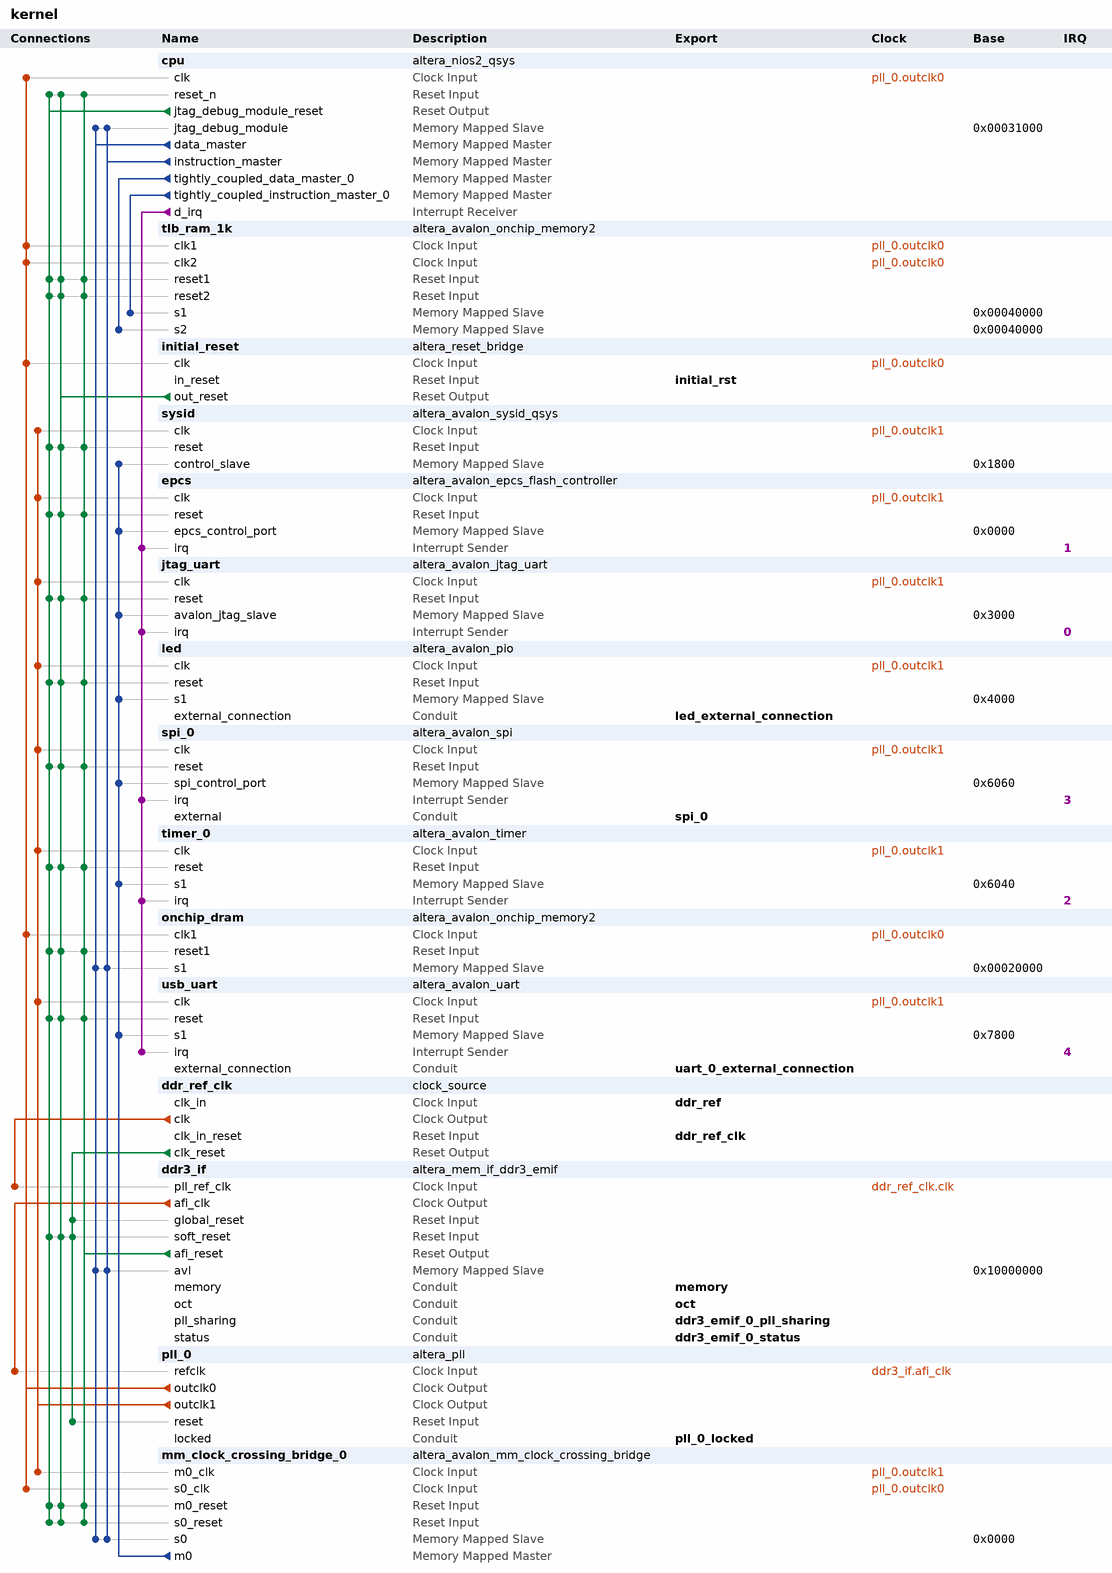
[diagram p0: system contents]
# Platform Designer (Qsys) system kernel, Cyclone V 5CEBA2F23C8
# Parameters at their usual value, and those the tool derives, are not listed.
package require -exact qsys 13.1
create_system kernel
set_project_property DEVICE_FAMILY {Cyclone V}
set_project_property DEVICE 5CEBA2F23C8

add_instance cpu altera_nios2_qsys 13.1
set_instance_parameter_value cpu muldiv_divider true
set_instance_parameter_value cpu mmu_enabled true
set_instance_parameter_value cpu mmu_autoAssignTlbPtrSz false
set_instance_parameter_value cpu manuallyAssignCpuID false
set_instance_parameter_value cpu resetSlave epcs.epcs_control_port
set_instance_parameter_value cpu mmu_TLBMissExcSlave tlb_ram_1k.s1
set_instance_parameter_value cpu exceptionSlave ddr3_if.avl
set_instance_parameter_value cpu breakSlave cpu.jtag_debug_module
set_instance_parameter_value cpu impl Fast
set_instance_parameter_value cpu icache_size 32768
set_instance_parameter_value cpu icache_numTCIM 1
set_instance_parameter_value cpu dcache_size 32768
set_instance_parameter_value cpu dcache_numTCDM 1

add_instance tlb_ram_1k altera_avalon_onchip_memory2 13.1
set_instance_parameter_value tlb_ram_1k dataWidth 32
set_instance_parameter_value tlb_ram_1k dualPort true
set_instance_parameter_value tlb_ram_1k initMemContent true
set_instance_parameter_value tlb_ram_1k initializationFileName onchip_mem.hex
set_instance_parameter_value tlb_ram_1k memorySize 1024

add_instance initial_reset altera_reset_bridge 13.1
set_instance_parameter_value initial_reset ACTIVE_LOW_RESET 1
set_instance_parameter_value initial_reset SYNCHRONOUS_EDGES deassert

add_instance sysid altera_avalon_sysid_qsys 13.1
set_instance_parameter_value sysid id 1577

add_instance epcs altera_avalon_epcs_flash_controller 13.1

add_instance jtag_uart altera_avalon_jtag_uart 13.1
set_instance_parameter_value jtag_uart simInteractiveOptions INTERACTIVE_ASCII_OUTPUT

add_instance led altera_avalon_pio 13.1
set_instance_parameter_value led direction Output
set_instance_parameter_value led width 4

add_instance spi_0 altera_avalon_spi 13.1
set_instance_parameter_value spi_0 clockPolarity 0
set_instance_parameter_value spi_0 dataWidth 8
set_instance_parameter_value spi_0 masterSPI true
set_instance_parameter_value spi_0 numberOfSlaves 1
set_instance_parameter_value spi_0 targetClockRate 20000000

add_instance timer_0 altera_avalon_timer 13.1
set_instance_parameter_value timer_0 period 1
set_instance_parameter_value timer_0 periodUnits MSEC

add_instance onchip_dram altera_avalon_onchip_memory2 13.1
set_instance_parameter_value onchip_dram dataWidth 32
set_instance_parameter_value onchip_dram dualPort false
set_instance_parameter_value onchip_dram initMemContent true
set_instance_parameter_value onchip_dram initializationFileName onchip_mem.hex
set_instance_parameter_value onchip_dram memorySize 32768

add_instance usb_uart altera_avalon_uart 13.1
set_instance_parameter_value usb_uart baud 115200
set_instance_parameter_value usb_uart dataBits 8
set_instance_parameter_value usb_uart fixedBaud true
set_instance_parameter_value usb_uart parity NONE
set_instance_parameter_value usb_uart stopBits 1

add_instance ddr_ref_clk clock_source 13.1
set_instance_parameter_value ddr_ref_clk clockFrequency 25000000

add_instance ddr3_if altera_mem_if_ddr3_emif 13.1
set_instance_parameter_value ddr3_if MEM_VENDOR Micron
set_instance_parameter_value ddr3_if MEM_FORMAT DISCRETE
set_instance_parameter_value ddr3_if MEM_CLK_FREQ_MAX 666.667
set_instance_parameter_value ddr3_if MEM_ROW_ADDR_WIDTH 13
set_instance_parameter_value ddr3_if MEM_COL_ADDR_WIDTH 10
set_instance_parameter_value ddr3_if MEM_DQ_WIDTH 16
set_instance_parameter_value ddr3_if MEM_BANKADDR_WIDTH 3
set_instance_parameter_value ddr3_if MEM_DRV_STR RZQ/6
set_instance_parameter_value ddr3_if MEM_RTT_WR {Dynamic ODT off}
set_instance_parameter_value ddr3_if MEM_WTCL 6
set_instance_parameter_value ddr3_if MEM_TCL 7
set_instance_parameter_value ddr3_if TIMING_TIS 190
set_instance_parameter_value ddr3_if TIMING_TIH 140
set_instance_parameter_value ddr3_if TIMING_TDS 30
set_instance_parameter_value ddr3_if TIMING_TDH 65
set_instance_parameter_value ddr3_if TIMING_TDQSQ 125
set_instance_parameter_value ddr3_if TIMING_TDQSCK 255
set_instance_parameter_value ddr3_if TIMING_TDQSS 0.25
set_instance_parameter_value ddr3_if TIMING_TQSH 0.4
set_instance_parameter_value ddr3_if TIMING_TDSH 0.2
set_instance_parameter_value ddr3_if TIMING_TDSS 0.2
set_instance_parameter_value ddr3_if MEM_TRAS_NS 36.0
set_instance_parameter_value ddr3_if MEM_TRCD_NS 13.5
set_instance_parameter_value ddr3_if MEM_TRP_NS 13.5
set_instance_parameter_value ddr3_if MEM_TRFC_NS 110.0
set_instance_parameter_value ddr3_if MEM_TWTR 4
set_instance_parameter_value ddr3_if MEM_TFAW_NS 45.0
set_instance_parameter_value ddr3_if MEM_TRRD_NS 7.5
set_instance_parameter_value ddr3_if MEM_TRTP_NS 7.5
set_instance_parameter_value ddr3_if RATE Half
set_instance_parameter_value ddr3_if MEM_CLK_FREQ 350.0
set_instance_parameter_value ddr3_if SPEED_GRADE 8
set_instance_parameter_value ddr3_if HARD_EMIF false
set_instance_parameter_value ddr3_if POWER_OF_TWO_BUS true
set_instance_parameter_value ddr3_if AVL_MAX_SIZE 4
set_instance_parameter_value ddr3_if PRIORITY_PORT 1,1,1,1,1,1
set_instance_parameter_value ddr3_if CPORT_TYPE_PORT Bidirectional,Bidirectional,Bidirectional,Bidirectional,Bidirectional,Bidirectional
set_instance_parameter_value ddr3_if REF_CLK_FREQ 25.0
set_instance_parameter_value ddr3_if DEFAULT_FAST_SIM_MODEL true
set_instance_parameter_value ddr3_if EXPORT_AFI_HALF_CLK false
set_instance_parameter_value ddr3_if PLL_LOCATION Top_Bottom
set_instance_parameter_value ddr3_if CALIBRATION_MODE Full
set_instance_parameter_value ddr3_if USER_DEBUG_LEVEL 0
set_instance_parameter_value ddr3_if TIMING_BOARD_MAX_CK_DELAY 0.6
set_instance_parameter_value ddr3_if TIMING_BOARD_MAX_DQS_DELAY 0.6
set_instance_parameter_value ddr3_if TIMING_BOARD_SKEW_CKDQS_DIMM_MIN -0.01
set_instance_parameter_value ddr3_if TIMING_BOARD_SKEW_CKDQS_DIMM_MAX 0.01
set_instance_parameter_value ddr3_if TIMING_BOARD_SKEW_WITHIN_DQS 0.02
set_instance_parameter_value ddr3_if TIMING_BOARD_SKEW_BETWEEN_DQS 0.02
set_instance_parameter_value ddr3_if TIMING_BOARD_DQ_TO_DQS_SKEW 0.0
set_instance_parameter_value ddr3_if TIMING_BOARD_AC_SKEW 0.02
set_instance_parameter_value ddr3_if TIMING_BOARD_AC_TO_CK_SKEW 0.0
set_instance_parameter_value ddr3_if CORE_DEBUG_CONNECTION INTERNAL_JTAG

add_instance pll_0 altera_pll 13.1
set_instance_parameter_value pll_0 gui_device_speed_grade 8
set_instance_parameter_value pll_0 gui_pll_mode {Integer-N PLL}
set_instance_parameter_value pll_0 gui_reference_clock_frequency 175.0
set_instance_parameter_value pll_0 gui_operation_mode direct
set_instance_parameter_value pll_0 gui_use_locked true
set_instance_parameter_value pll_0 gui_number_of_clocks 2
set_instance_parameter_value pll_0 gui_output_clock_frequency0 100.0
set_instance_parameter_value pll_0 gui_output_clock_frequency1 40.0

add_instance mm_clock_crossing_bridge_0 altera_avalon_mm_clock_crossing_bridge 13.1
set_instance_parameter_value mm_clock_crossing_bridge_0 DATA_WIDTH 32
set_instance_parameter_value mm_clock_crossing_bridge_0 ADDRESS_WIDTH 17
set_instance_parameter_value mm_clock_crossing_bridge_0 MAX_BURST_SIZE 1
set_instance_parameter_value mm_clock_crossing_bridge_0 COMMAND_FIFO_DEPTH 4
set_instance_parameter_value mm_clock_crossing_bridge_0 RESPONSE_FIFO_DEPTH 4
set_instance_parameter_value mm_clock_crossing_bridge_0 MASTER_SYNC_DEPTH 2
set_instance_parameter_value mm_clock_crossing_bridge_0 SLAVE_SYNC_DEPTH 2

# connections
add_connection ddr3_if.afi_clk pll_0.refclk clock
add_connection ddr_ref_clk.clk ddr3_if.pll_ref_clk clock
add_connection pll_0.outclk0 cpu.clk clock
add_connection pll_0.outclk0 initial_reset.clk clock
add_connection pll_0.outclk0 mm_clock_crossing_bridge_0.s0_clk clock
add_connection pll_0.outclk0 onchip_dram.clk1 clock
add_connection pll_0.outclk0 tlb_ram_1k.clk1 clock
add_connection pll_0.outclk0 tlb_ram_1k.clk2 clock
add_connection pll_0.outclk1 epcs.clk clock
add_connection pll_0.outclk1 jtag_uart.clk clock
add_connection pll_0.outclk1 led.clk clock
add_connection pll_0.outclk1 mm_clock_crossing_bridge_0.m0_clk clock
add_connection pll_0.outclk1 spi_0.clk clock
add_connection pll_0.outclk1 sysid.clk clock
add_connection pll_0.outclk1 timer_0.clk clock
add_connection pll_0.outclk1 usb_uart.clk clock
add_connection cpu.jtag_debug_module_reset cpu.reset_n reset
add_connection cpu.jtag_debug_module_reset ddr3_if.soft_reset reset
add_connection cpu.jtag_debug_module_reset epcs.reset reset
add_connection cpu.jtag_debug_module_reset jtag_uart.reset reset
add_connection cpu.jtag_debug_module_reset led.reset reset
add_connection cpu.jtag_debug_module_reset mm_clock_crossing_bridge_0.m0_reset reset
add_connection cpu.jtag_debug_module_reset mm_clock_crossing_bridge_0.s0_reset reset
add_connection cpu.jtag_debug_module_reset onchip_dram.reset1 reset
add_connection cpu.jtag_debug_module_reset spi_0.reset reset
add_connection cpu.jtag_debug_module_reset sysid.reset reset
add_connection cpu.jtag_debug_module_reset timer_0.reset reset
add_connection cpu.jtag_debug_module_reset tlb_ram_1k.reset1 reset
add_connection cpu.jtag_debug_module_reset tlb_ram_1k.reset2 reset
add_connection cpu.jtag_debug_module_reset usb_uart.reset reset
add_connection ddr3_if.afi_reset cpu.reset_n reset
add_connection ddr3_if.afi_reset epcs.reset reset
add_connection ddr3_if.afi_reset jtag_uart.reset reset
add_connection ddr3_if.afi_reset led.reset reset
add_connection ddr3_if.afi_reset mm_clock_crossing_bridge_0.m0_reset reset
add_connection ddr3_if.afi_reset mm_clock_crossing_bridge_0.s0_reset reset
add_connection ddr3_if.afi_reset onchip_dram.reset1 reset
add_connection ddr3_if.afi_reset spi_0.reset reset
add_connection ddr3_if.afi_reset sysid.reset reset
add_connection ddr3_if.afi_reset timer_0.reset reset
add_connection ddr3_if.afi_reset tlb_ram_1k.reset1 reset
add_connection ddr3_if.afi_reset tlb_ram_1k.reset2 reset
add_connection ddr3_if.afi_reset usb_uart.reset reset
add_connection ddr_ref_clk.clk_reset ddr3_if.global_reset reset
add_connection ddr_ref_clk.clk_reset ddr3_if.soft_reset reset
add_connection ddr_ref_clk.clk_reset pll_0.reset reset
add_connection initial_reset.out_reset cpu.reset_n reset
add_connection initial_reset.out_reset ddr3_if.soft_reset reset
add_connection initial_reset.out_reset epcs.reset reset
add_connection initial_reset.out_reset jtag_uart.reset reset
add_connection initial_reset.out_reset led.reset reset
add_connection initial_reset.out_reset mm_clock_crossing_bridge_0.m0_reset reset
add_connection initial_reset.out_reset mm_clock_crossing_bridge_0.s0_reset reset
add_connection initial_reset.out_reset onchip_dram.reset1 reset
add_connection initial_reset.out_reset spi_0.reset reset
add_connection initial_reset.out_reset sysid.reset reset
add_connection initial_reset.out_reset timer_0.reset reset
add_connection initial_reset.out_reset tlb_ram_1k.reset1 reset
add_connection initial_reset.out_reset tlb_ram_1k.reset2 reset
add_connection initial_reset.out_reset usb_uart.reset reset
add_connection cpu.data_master cpu.jtag_debug_module avalon
set_connection_parameter_value cpu.data_master/cpu.jtag_debug_module baseAddress 0x00031000
add_connection cpu.data_master ddr3_if.avl avalon
set_connection_parameter_value cpu.data_master/ddr3_if.avl baseAddress 0x10000000
add_connection cpu.data_master mm_clock_crossing_bridge_0.s0 avalon
set_connection_parameter_value cpu.data_master/mm_clock_crossing_bridge_0.s0 baseAddress 0x0000
add_connection cpu.data_master onchip_dram.s1 avalon
set_connection_parameter_value cpu.data_master/onchip_dram.s1 baseAddress 0x00020000
add_connection cpu.instruction_master cpu.jtag_debug_module avalon
set_connection_parameter_value cpu.instruction_master/cpu.jtag_debug_module baseAddress 0x00031000
add_connection cpu.instruction_master ddr3_if.avl avalon
set_connection_parameter_value cpu.instruction_master/ddr3_if.avl baseAddress 0x10000000
add_connection cpu.instruction_master mm_clock_crossing_bridge_0.s0 avalon
set_connection_parameter_value cpu.instruction_master/mm_clock_crossing_bridge_0.s0 baseAddress 0x0000
add_connection cpu.instruction_master onchip_dram.s1 avalon
set_connection_parameter_value cpu.instruction_master/onchip_dram.s1 baseAddress 0x00020000
add_connection cpu.tightly_coupled_data_master_0 tlb_ram_1k.s2 avalon
set_connection_parameter_value cpu.tightly_coupled_data_master_0/tlb_ram_1k.s2 baseAddress 0x00040000
add_connection cpu.tightly_coupled_instruction_master_0 tlb_ram_1k.s1 avalon
set_connection_parameter_value cpu.tightly_coupled_instruction_master_0/tlb_ram_1k.s1 baseAddress 0x00040000
add_connection mm_clock_crossing_bridge_0.m0 epcs.epcs_control_port avalon
set_connection_parameter_value mm_clock_crossing_bridge_0.m0/epcs.epcs_control_port baseAddress 0x0000
add_connection mm_clock_crossing_bridge_0.m0 jtag_uart.avalon_jtag_slave avalon
set_connection_parameter_value mm_clock_crossing_bridge_0.m0/jtag_uart.avalon_jtag_slave baseAddress 0x3000
add_connection mm_clock_crossing_bridge_0.m0 led.s1 avalon
set_connection_parameter_value mm_clock_crossing_bridge_0.m0/led.s1 baseAddress 0x4000
add_connection mm_clock_crossing_bridge_0.m0 spi_0.spi_control_port avalon
set_connection_parameter_value mm_clock_crossing_bridge_0.m0/spi_0.spi_control_port baseAddress 0x6060
add_connection mm_clock_crossing_bridge_0.m0 sysid.control_slave avalon
set_connection_parameter_value mm_clock_crossing_bridge_0.m0/sysid.control_slave baseAddress 0x1800
add_connection mm_clock_crossing_bridge_0.m0 timer_0.s1 avalon
set_connection_parameter_value mm_clock_crossing_bridge_0.m0/timer_0.s1 baseAddress 0x6040
add_connection mm_clock_crossing_bridge_0.m0 usb_uart.s1 avalon
set_connection_parameter_value mm_clock_crossing_bridge_0.m0/usb_uart.s1 baseAddress 0x7800
add_connection cpu.d_irq epcs.irq interrupt
set_connection_parameter_value cpu.d_irq/epcs.irq irqNumber 1
add_connection cpu.d_irq jtag_uart.irq interrupt
set_connection_parameter_value cpu.d_irq/jtag_uart.irq irqNumber 0
add_connection cpu.d_irq spi_0.irq interrupt
set_connection_parameter_value cpu.d_irq/spi_0.irq irqNumber 3
add_connection cpu.d_irq timer_0.irq interrupt
set_connection_parameter_value cpu.d_irq/timer_0.irq irqNumber 2
add_connection cpu.d_irq usb_uart.irq interrupt
set_connection_parameter_value cpu.d_irq/usb_uart.irq irqNumber 4

# exported interfaces
add_interface led_external_connection conduit end
set_interface_property led_external_connection EXPORT_OF led.external_connection
add_interface uart_0_external_connection conduit end
set_interface_property uart_0_external_connection EXPORT_OF usb_uart.external_connection
add_interface memory conduit end
set_interface_property memory EXPORT_OF ddr3_if.memory
add_interface oct conduit end
set_interface_property oct EXPORT_OF ddr3_if.oct
add_interface ddr3_emif_0_pll_sharing conduit end
set_interface_property ddr3_emif_0_pll_sharing EXPORT_OF ddr3_if.pll_sharing
add_interface ddr3_emif_0_status conduit end
set_interface_property ddr3_emif_0_status EXPORT_OF ddr3_if.status
add_interface spi_0 conduit end
set_interface_property spi_0 EXPORT_OF spi_0.external
add_interface pll_0_locked conduit end
set_interface_property pll_0_locked EXPORT_OF pll_0.locked
add_interface ddr_ref clock sink
set_interface_property ddr_ref EXPORT_OF ddr_ref_clk.clk_in
add_interface initial_rst reset sink
set_interface_property initial_rst EXPORT_OF initial_reset.in_reset
add_interface ddr_ref_clk reset sink
set_interface_property ddr_ref_clk EXPORT_OF ddr_ref_clk.clk_in_reset

set_interconnect_requirement {$system} qsys_mm.clockCrossingAdapter FIFO
set_interconnect_requirement {$system} qsys_mm.maxAdditionalLatency 0

save_system kernel.qsys
